# Altium schematic sheet Reception.SchDoc
size A4
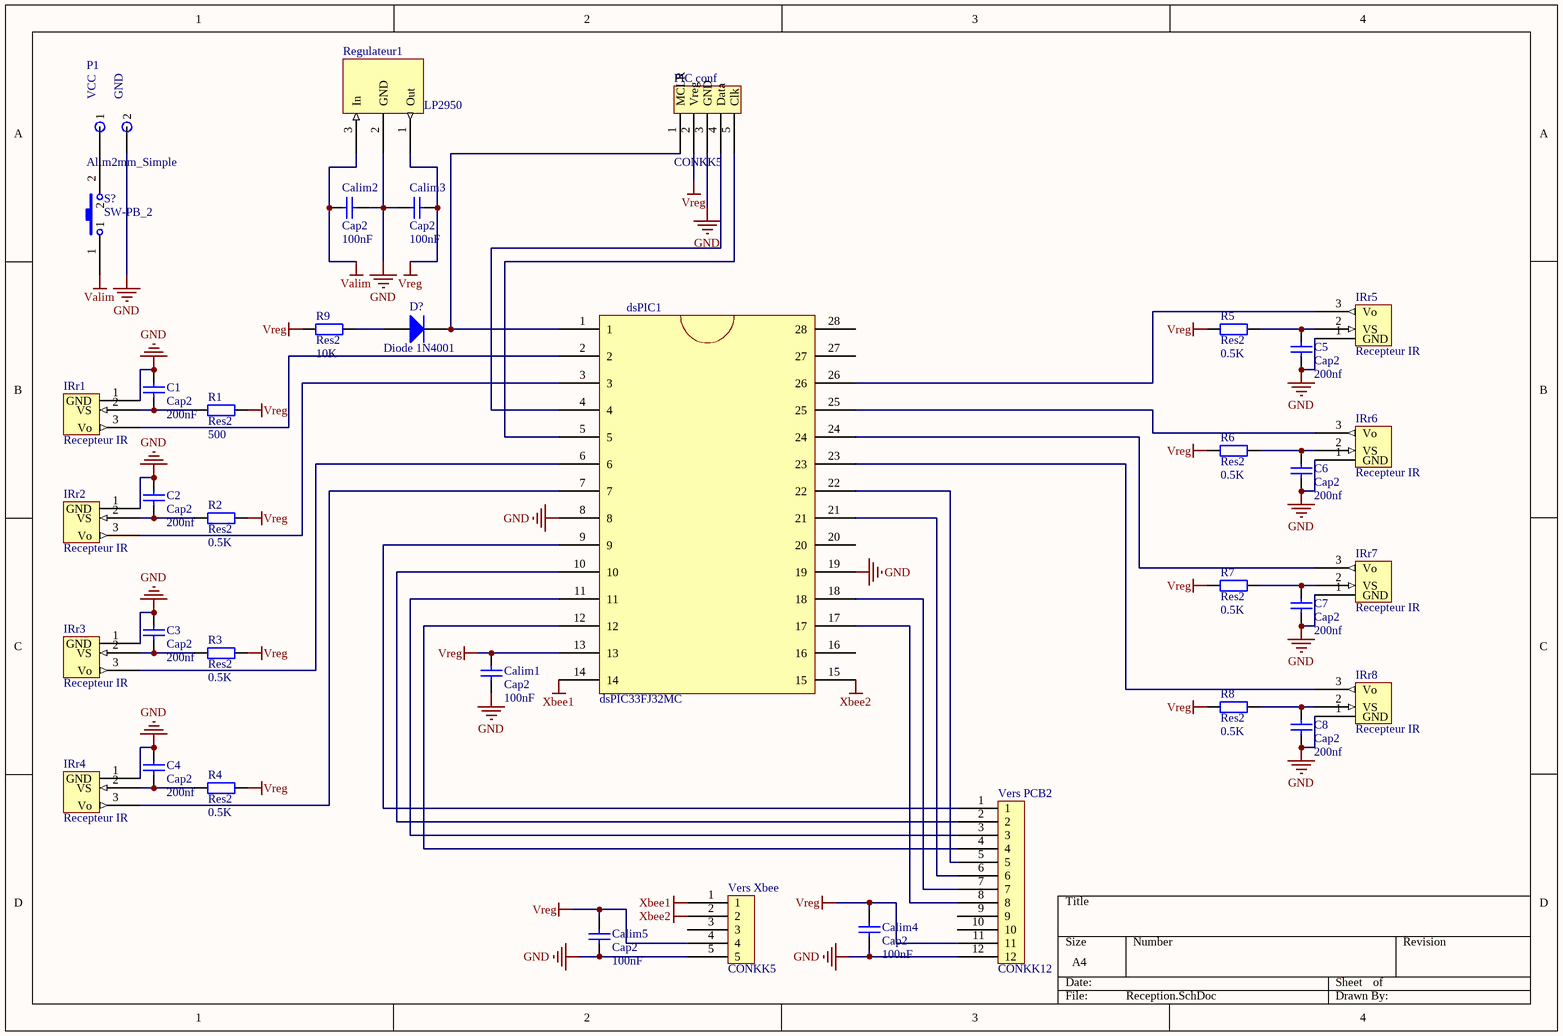
[diagram p0: Reception.SchDoc]

## Parts
C1  Cap2  value 200nF  [CAPA2]
C2  Cap2  value 200nf  [CAPA2]
C3  Cap2  value 200nf  [CAPA2]
C4  Cap2  value 200nf  [CAPA2]
C5  Cap2  value 200nf  [CAPA2]
C6  Cap2  value 200nf  [CAPA2]
C7  Cap2  value 200nf  [CAPA2]
C8  Cap2  value 200nf  [CAPA2]
Calim1  Cap2  value 100nF  [CAPA2]
Calim2  Cap2  value 100nF  [CAPA2]
Calim3  Cap2  value 100nF  [CAPA2]
Calim4  Cap2  value 100nF  [CAPA2]
Calim5  Cap2  value 100nF  [CAPA2]
D?  Diode 1N4001  [Ddiode]
dsPIC1  dsPIC33FJ32MC  [PCBComponent_1]
IRr1  Recepteur IR  [TSOP1138]
IRr2  Recepteur IR  [TSOP1138]
IRr3  Recepteur IR  [TSOP1138]
IRr4  Recepteur IR  [TSOP1138]
IRr5  Recepteur IR  [TSOP1138]
IRr6  Recepteur IR  [TSOP1138]
IRr7  Recepteur IR  [TSOP1138]
IRr8  Recepteur IR  [TSOP1138]
P1  Alim2mm_Simple  [Alim2mm_simple]
PIC_conf  CONKK5  [CONKK5]
R1  Res2  value 500  [res5_1/4W]
R2  Res2  value 0.5K  [res5_1/4W]
R3  Res2  value 0.5K  [res5_1/4W]
R4  Res2  value 0.5K  [res5_1/4W]
R5  Res2  value 0.5K  [res5_1/4W]
R6  Res2  value 0.5K  [res5_1/4W]
R7  Res2  value 0.5K  [res5_1/4W]
R8  Res2  value 0.5K  [res5_1/4W]
R9  Res2  value 10K  [res5_1/4W]
Regulateur1  LP2950  [PCBComponent_1]
S?  SW-PB_2  [SW_BP_2]
Vers_PCB2  CONKK12  [CONKK12]
Vers_Xbee  CONKK5  [CONKK5]

## Nets
GND: C1.2 C2.2 C3.2 C4.2 C5.2 C6.2 C7.2 C8.2 Calim1.2 Calim2.2 Calim3.1 Calim4.1 Calim5.1 dsPIC1.8 dsPIC1.19 IRr1.1(GND) IRr2.1(GND) IRr3.1(GND) IRr4.1(GND) IRr5.1(GND) IRr6.1(GND) IRr7.1(GND) IRr8.1(GND) P1.2 PIC_conf.3(GND) Regulateur1.2(GND) Vers_PCB2.12 Vers_Xbee.5
Valim: Calim2.1 Regulateur1.3(In) S?.1
Vreg: Calim1.1 Calim3.2 Calim4.2 Calim5.2 dsPIC1.13 PIC_conf.2(Vreg) R1.2 R2.2 R3.2 R4.2 R5.2 R6.2 R7.2 R8.2 R9.1 Regulateur1.1(Out) Vers_PCB2.11 Vers_Xbee.4
Xbee1: dsPIC1.14 Vers_Xbee.1
Xbee2: dsPIC1.15 Vers_Xbee.2
NetC1_1: C1.1 IRr1.2(VS) R1.1
NetC2_1: C2.1 IRr2.2(VS) R2.1
NetC3_1: C3.1 IRr3.2(VS) R3.1
NetC4_1: C4.1 IRr4.2(VS) R4.1
NetC5_1: C5.1 IRr5.2(VS) R5.1
NetC6_1: C6.1 IRr6.2(VS) R6.1
NetC7_1: C7.1 IRr7.2(VS) R7.1
NetC8_1: C8.1 IRr8.2(VS) R8.1
NetD?_1: D?.1(A) R9.2
NetD?_2: D?.2(K) dsPIC1.1 PIC_conf.1(MCLR)
NetdsPIC1_2: dsPIC1.2 IRr1.3(Vo)
NetdsPIC1_3: dsPIC1.3 IRr2.3(Vo)
NetdsPIC1_4: dsPIC1.4 PIC_conf.4(Data)
NetdsPIC1_5: dsPIC1.5 PIC_conf.5(Clk)
NetdsPIC1_6: dsPIC1.6 IRr3.3(Vo)
NetdsPIC1_7: dsPIC1.7 IRr4.3(Vo)
NetdsPIC1_9: dsPIC1.9 Vers_PCB2.1
NetdsPIC1_10: dsPIC1.10 Vers_PCB2.2
NetdsPIC1_11: dsPIC1.11 Vers_PCB2.3
NetdsPIC1_12: dsPIC1.12 Vers_PCB2.4
NetdsPIC1_17: dsPIC1.17 Vers_PCB2.8
NetdsPIC1_18: dsPIC1.18 Vers_PCB2.7
NetdsPIC1_21: dsPIC1.21 Vers_PCB2.6
NetdsPIC1_22: dsPIC1.22 Vers_PCB2.5
NetdsPIC1_23: dsPIC1.23 IRr8.3(Vo)
NetdsPIC1_24: dsPIC1.24 IRr7.3(Vo)
NetdsPIC1_25: dsPIC1.25 IRr6.3(Vo)
NetdsPIC1_26: dsPIC1.26 IRr5.3(Vo)
NetP1_1: P1.1 S?.2

Not connected (* = marked no-connect by the designer): dsPIC1 16 20 27 28; Vers_PCB2 9 10; Vers_Xbee 3

## Notes on the sheet
- (in symbol Alim2mm_Simple) VCC; GND

## Library data of the parts
C1-C8 Calim1-Calim5 = Cap2: Capacitor; Published: 8-Jun-2000; LatestRevisionDate: 17-Jul-2002; LatestRevisionNote: Re-released for DXP Platform.; PackageReference: RAD-0.3; Publisher: Altium Limited
D? = Diode 1N4001: 1 Amp General Purpose Rectifier; pin to pad: 1>A 2>K; Published: 8-Jun-2000; LatestRevisionDate: 17-Jul-2002; LatestRevisionNote: Re-released for DXP Platform.; DatasheetDocument: 1998; PackageDocument: Aug-1999; PackageReference: DO-41; Publisher: Altium Limited; Code_JEDEC: DO-204-AL; ComponentLink1Description: Manufacturer Link; ComponentLink1URL: http://www.fairchildsemi.com/; ComponentLink2Description: Datasheet; ComponentLink2URL: http://www.fairchildsemi.com/ds/1N%2F1N4001.pdf
IRr1-IRr8 = TSOP1138: pin to pad: 1>GND 2>Vs 3>Vo
P1 = Alim2mm_Simple: 2-Pin; LatestRevisionDate: 17-Jul-2002; LatestRevisionNote: Re-released for DXP Platform.; Publisher: Altium Limited
R1-R9 = Res2: Resistor; Published: 8-Jun-2000; LatestRevisionDate: 17-Jul-2002; LatestRevisionNote: Re-released for DXP Platform.; PackageReference: AXIAL-0.4; Publisher: Altium Limited
Regulateur1 = LP2950: pin to pad: 1>Out 2>GND 3>In
S? = SW-PB_2: Switch; Published: 24-Mar-1999; LatestRevisionDate: 17-Jul-2002; LatestRevisionNote: Re-released for DXP Platform.; PackageReference: SPST-2; Publisher: Altium Limited